# Altium schematic sheet Latch_IMD.SchDoc
size A4
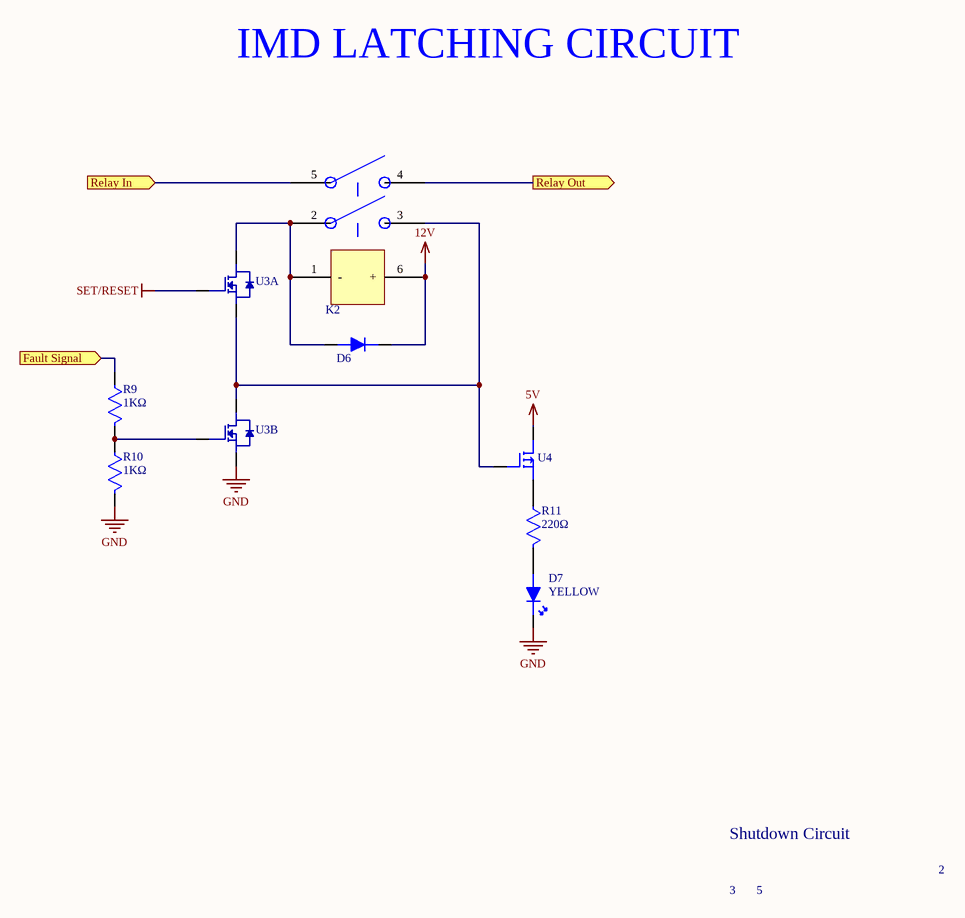
[diagram p0: Latch_IMD.SchDoc]

## Parts
D6  SD560BTR  [DIODE]  (value not drawn)
D7  YELLOW  [LED 0603]
K2  5-1419124-6  [RELAY DPST SDC]  (value not drawn)
R9  1KΩ  [RESISTOR 0603]
R10  1KΩ  [RESISTOR 0603]
R11  220Ω  [RESISTOR 0603]
U3  SSM6N7002CFU,LF  [N-MOSFET (2 FETS)]  (value not drawn)  (parts A,B of 2)
U4  NTD2955T4GOSCT-ND  [DPAK-TO252]  (value not drawn)

## Ports
Fault Signal (in), Relay In (in), Relay Out (out)

## Nets
5V: U4.2
12V: D6.2 K2.6(+)
GND: D7.2 R10.2 U3.4(S2)
SET/RESET: U3.2(G1)
Fault Signal: R9.1 ; port Fault Signal
Relay In: K2.5 ; port Relay In
Relay Out: K2.4 ; port Relay Out
NetD6_1: D6.1 K2.1(-) K2.2 U3.6(D1)
NetD7_1: D7.1 R11.2
NetK2_3: K2.3 U3.1(S1) U3.3(D2) U4.1
NetR9_2: R9.2 R10.1 U3.5(G2)
NetR11_1: R11.1 U4.3

## Notes on the sheet
- IMD LATCHING CIRCUIT
- Shutdown Circuit
- 2
- 3
- 5
- Title
- Size:
- A4
- Revision:
- Sheet
- of
- Date:

## Library data of the parts
D6 = SD560BTR: DIODE GEN PURP 600V 5A SMB; Manufacturer: SMC; Supplier 1: Digi-Key; Manufacturer Part Number: SD560BTR; Stock 1: 90144; Pricing 1: 1=0.42, 10=0.309, 100=0.1468, 500=0.11978, 1000=0.08887 (USD); Mount: Surface Mount; Packaging: Tape and Reel; Max Reverse Voltage (DC): 600V; ComponentLink1URL: http://www.smc-diodes.com/propdf/SD560B%20N1412%20REV.D.pdf?src-supplier=Digi-Key; ComponentLink1Description: http://www.smc-diodes.com/propdf/SD560B%20N1412%20REV.D.pdf?src-supplier=Digi-Key; Supplier Part Number 1: 1655-1530-6-ND; Category: Discrete Semiconductor Products; Average Rectified Current: 5A; Case/Package: SMB
D7 = LTST-C191KSKT: LED YELLOW CLEAR SMD; Manufacturer: Vishay Lite-On; Lens Color: Colorless; Viewing Angle: 130°; Lens Style: Diffused,Colorless,Rectangular,Clear; Luminous Intensity: 180mcd; Forward Current: 30mA; Forward Voltage: 2.4V; Power Rating: 75mW; Dominant Wavelength: 597nm; Test Current: 20mA; Number of Elements: 1; Wavelength: 588nm; Reverse Voltage: 5V; Supplier 1: Digi-Key; Manufacturer Part Number: LTST-C191KSKT; Stock 1: 464545; Pricing 1: 1=0.29, 10=0.215, 100=0.1016, 500=0.06774, 1000=0.05306, 2500=0.05194 (USD); Mount: Surface Mount; Case/Package: 0603; Number of Pins: 2; Color: Yellow; Case Code (Metric): 1608; Case Code (Imperial): 0603; Min Operating Temperature: -55°C; Max Operating Temperature: 85°C; Package Quantity: 1; Packaging: Tape and Reel; Illumination Color: Yellow; Lens Transparency: Clear; Power Dissipation: 75mW; Number of LEDs: 1; Length: 1.6mm; Height: 0.55mm; Width: 0.8mm; Depth: 0.8mm; Radiation Hardening: No; Lead Free: Lead Free; ComponentLink1URL: http://optoelectronics.liteon.com/upload/download/DS22-2000-224/LTST-C191KSKT.PDF?src-supplier=Digi-Key; ComponentLink1Description: http://optoelectronics.liteon.com/upload/download/DS22-2000-224/LTST-C191KSKT.PDF?src-supplier=Digi-Key; ComponentLink2URL: https://www.verical.com/server-webapp/html/getDatasheet?partID=141495&src-supplier=Verical; ComponentLink2Description: https://www.verical.com/server-webapp/html/getDatasheet?partID=141495&src-supplier=Verical; ComponentLink3URL: http://www.mouser.com/ds/2/239/LTST-C191KSKT-1141271.pdf?src-supplier=Mouser; ComponentLink3Description: http://www.mouser.com/ds/2/239/LTST-C191KSKT-1141271.pdf?src-supplier=Mouser; ComponentLink4URL: http://www1.futureelectronics.com/doc/LITE%20ON/LITE-ON%20LTST-C191KSKT.pdf?src-supplier=Future+Electronics; ComponentLink4Description: http://www1.futureelectronics.com/doc/LITE%20ON/LITE-ON%20LTST-C191KSKT.pdf?src-supplier=Future+Electronics; Category: Optoelectronics; Supplier Part Number 1: 160-1448-6-ND
K2 = 5-1419124-6: General Purpose Relay, Osa Series, Power, Non Latching, Dpst-No, 12 Vdc, 3 A Rohs Compliant: Yes; Manufacturer: TE Connectivity; Contact Current Rating: 3A; Coil Current: 45mA; Throw Configuration: DPST; Operate Time: 20ms; Release Time: 10ms; Coil Power: 600mW; Coil Resistance: 270R; Coil Type: Non-Latching; Coil Voltage (DC): 12V; Contact Voltage Rating (AC): 240V; Supplier 1: Digi-Key; Manufacturer Part Number: 5-1419124-6; Stock 1: 2593; Pricing 1: 1=2.54, 10=2.385, 25=2.1204, 50=2.0142, 100=1.9083, 250=1.69624, 500=1.59022, 1000=1.48421, 5000=1.4312 (USD); Mount: Through Hole; Weight: 13g; Contact Material: Silver; Min Operating Temperature: -30°C; Max Operating Temperature: 60°C; Package Quantity: 1000; Packaging: Box; Termination: PCB; Relay Type: General Purpose; Length: 24.4mm; Height: 0.976inch; Width: 12.9mm; ELV: Compliant; REACH SVHC: Unknown; ComponentLink1URL: http://www.farnell.com/datasheets/1652820.pdf?src-supplier=Farnell; ComponentLink1Description: http://www.farnell.com/datasheets/1652820.pdf?src-supplier=Farnell; ComponentLink2URL: http://www.farnell.com/cad/1652820.pdf?src-supplier=Element14; ComponentLink2Description: http://www.farnell.com/cad/1652820.pdf?src-supplier=Element14; ComponentLink3URL: http://www.te.com/commerce/DocumentDelivery/DDEController?Action=srchrtrv&DocNm=5-1419124-6&DocType=Customer+Drawing&DocLang=English&src-supplier=Digi-Key; ComponentLink3Description: http://www.te.com/commerce/DocumentDelivery/DDEController?Action=srchrtrv&DocNm=5-1419124-6&DocType=Customer+Drawing&DocLang=English&src-supplier=Digi-Key; Supplier Part Number 1: OSA-SS-212DM3,000-ND; Category: Relays
R9-R11 = CRCW0603220RJNEA: RES SMD 220 OHM 5% 1/10W 0603; Manufacturer: Vishay; Resistance: 220R; Power Rating: 100mW; Voltage Rating: 75V; Temperature Coefficient: 200ppm/°C; Supplier 1: Digi-Key; Manufacturer Part Number: CRCW0603220RJNEA; Stock 1: 171552; Pricing 1: 1=0.1, 10=0.031, 100=0.0125, 1000=0.00562, 2500=0.00488 (USD); Mount: Surface Mount; Case/Package: 0603; Weight: 7.1E-05oz; Case Code (Metric): 1608; Case Code (Imperial): 0603; Contact Plating: Tin; Min Operating Temperature: -55°C; Max Operating Temperature: 155°C; Tolerance: 5%; Packaging: Tape and Reel; Package Quantity: 1; Composition: Thick Film; Number of Terminations: 2; Military Standard: Not; Termination: SMD/SMT; Max Power Dissipation: 100mW; Working Voltage: 75V; Features: Automotive AEC-Q200; Length: 1.55mm; Height: 0.45mm; Width: 0.033inch; Depth: 0.85mm; Radiation Hardening: No; REACH SVHC: Unknown; ComponentLink1URL: http://www.vishay.com/docs/20035/dcrcwe3.pdf?src-supplier=Digi-Key; ComponentLink1Description: http://www.vishay.com/docs/20035/dcrcwe3.pdf?src-supplier=Digi-Key; ComponentLink2URL: http://www.vishay.com/docs/20035/dcrcwe3.pdf?src-supplier=Avnet; ComponentLink2Description: http://www.vishay.com/docs/20035/dcrcwe3.pdf?src-supplier=Avnet; ComponentLink3URL: http://www.alliedelec.com/m/d/0c934d6939ccefa68dbe0b96d821c8cf.pdf?src-supplier=Allied+Electronics; ComponentLink3Description: http://www.alliedelec.com/m/d/0c934d6939ccefa68dbe0b96d821c8cf.pdf?src-supplier=Allied+Electronics; ComponentLink4URL: http://www.farnell.com/datasheets/2045673.pdf?src-supplier=Element14; ComponentLink4Description: http://www.farnell.com/datasheets/2045673.pdf?src-supplier=Element14; ComponentLink5URL: http://www.mouser.com/ds/2/427/dcrcwe3-109170.pdf?src-supplier=Mouser; ComponentLink5Description: http://www.mouser.com/ds/2/427/dcrcwe3-109170.pdf?src-supplier=Mouser; Supplier Part Number 1: 541-220GCT-ND; Category: Resistors
U3 = SSM6N7002CFU,LF: MOSFET 2N-CH 60V 0.17A US6; Manufacturer: Toshiba; Continuous Drain Current (ID): 170mA; Rds On Max: 3.9R; Input Capacitance: 17pF; Max Power Dissipation: 285mW; FET Type: 2 N-Channel; Supplier 1: Digi-Key; Manufacturer Part Number: SSM6N7002CFU,LF; Stock 1: 13946; Pricing 1: 1=0.27, 10=0.221, 100=0.0906, 500=0.0756, 1000=0.05253 (USD); Mount: Surface Mount; Case/Package: SOT-363; Packaging: Tape and Reel; Drain to Source Voltage (Vdss): 60V; ComponentLink1URL: https://toshiba.semicon-storage.com/info/docget.jsp?did=29875&prodName=SSM6N7002CFU&src-supplier=Digi-Key; ComponentLink1Description: https://toshiba.semicon-storage.com/info/docget.jsp?did=29875&prodName=SSM6N7002CFU&src-supplier=Digi-Key; ComponentLink2URL: http://www.mouser.com/ds/2/408/SSM6N7002CFU_datasheet_en_20150413-736631.pdf?src-supplier=Mouser; ComponentLink2Description: http://www.mouser.com/ds/2/408/SSM6N7002CFU_datasheet_en_20150413-736631.pdf?src-supplier=Mouser; Category: Discrete Semiconductor Products; Supplier Part Number 1: SSM6N7002CFULFDKR-ND
U4 = P-FET-60V-12A: MOSFET P-CH 60V 12A DPAK; Manufacturer: ON Semiconductor; Rise Time: 45ns; Nominal Vgs: -2.8V; Input Capacitance: 750pF; Max Power Dissipation: 55W; Number of Elements: 1; Rds On Max: 180mR; Fall Time: 48ns; Drain to Source Resistance: 155mR; Turn-Off Delay Time: 26ns; Drain to Source Voltage (Vdss): -60V; Turn-On Delay Time: 10ns; Element Configuration: Single; Gate to Source Voltage (Vgs): 20V; Current Rating: -12A; Supplier 1: Digi-Key; Manufacturer Part Number: NTD2955T4G; Stock 1: 9993; Pricing 1: 1=0.76, 10=0.672, 25=0.6316, 100=0.4583, 250=0.44204, 500=0.38296, 1000=0.32592 (USD); Case/Package: DPAK; Number of Pins: 3; Contact Plating: Tin,Matte; Min Operating Temperature: -55°C; Max Operating Temperature: 175°C; Package Quantity: 1; Packaging: Tape and Reel; Power Dissipation: 55W; Continuous Drain Current (ID): 12A; Threshold Voltage: -2.8V; Drain to Source Breakdown Voltage: -60V; Voltage Rating (DC): -60V; On-State Resistance: 180mR; Number of Channels: 1; Length: 6.73mm; Height: 2.38mm; Width: 6.22mm; Radiation Hardening: No; REACH SVHC: No SVHC; Lead Free: Lead Free; ComponentLink1URL: http://www.onsemi.com/pub/Collateral/NTD2955-D.PDF?src-supplier=Avnet; ComponentLink1Description: http://www.onsemi.com/pub/Collateral/NTD2955-D.PDF?src-supplier=Avnet; ComponentLink2URL: http://www.onsemi.com/pub/Collateral/NTD2955-D.PDF?src-supplier=Avnet+Europe; ComponentLink2Description: http://www.onsemi.com/pub/Collateral/NTD2955-D.PDF?src-supplier=Avnet+Europe; ComponentLink3URL: http://www.onsemi.com/pub_link/Collateral/NTD2955-D.PDF?src-supplier=Element14; ComponentLink3Description: http://www.onsemi.com/pub_link/Collateral/NTD2955-D.PDF?src-supplier=Element14; ComponentLink4URL: http://www.onsemi.com/pub/Collateral/NTD2955-D.PDF?src-supplier=Digi-Key; ComponentLink4Description: http://www.onsemi.com/pub/Collateral/NTD2955-D.PDF?src-supplier=Digi-Key; ComponentLink5URL: http://www.jameco.com/Jameco/Products/ProdDS/1178118.pdf?src-supplier=Jameco; ComponentLink5Description: http://www.jameco.com/Jameco/Products/ProdDS/1178118.pdf?src-supplier=Jameco; Supplier Part Number 1: NTD2955T4GOSDKR-ND